# EAGLE design solenoid_1ch (EAGLE 8.1.0)
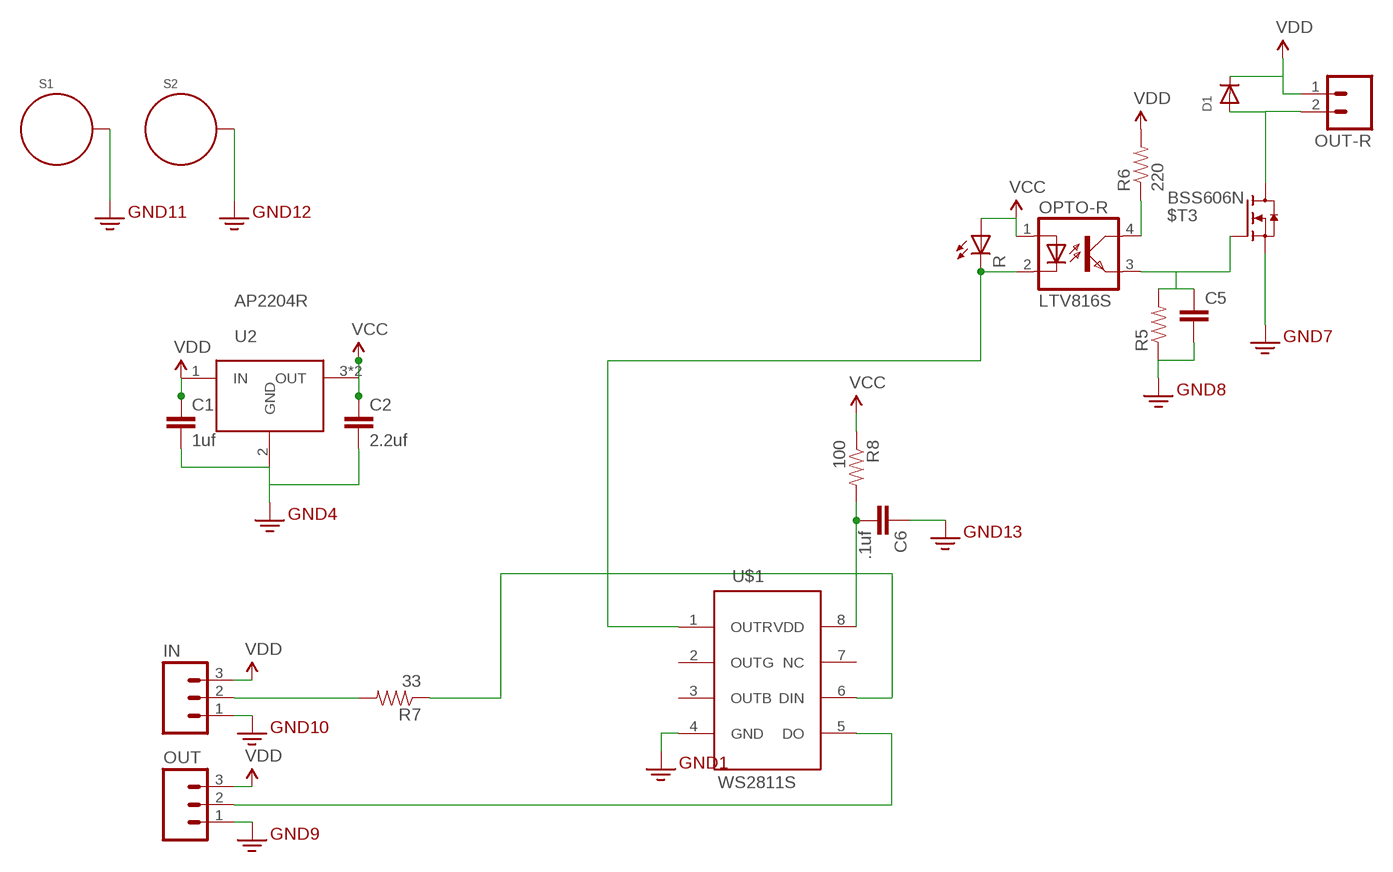
[diagram p0: schematic, sheet 1]

## Parts
$T3  BSS606N  [SOT89R]
C1  1uf  CAP0805  [0805]
C2  2.2uf  CAP0805  [0805]
C5  CAP0805  [0805]
C6  .1uf  CAP0805  [0805]
D1  DIODESOD-123  [SOD-123]
IN  M031X03_NO_SILK  [1X03_NO_SILK]
OPTO-R  LTV816S  [SMD4]
OUT  M031X03_NO_SILK  [1X03_NO_SILK]
OUT-R  M02PTH  [1X02]
R  LEDCHIPLED_0805  [CHIPLED_0805]
R5  RESISTOR0805-RES  [0805]
R6  220  RESISTOR0805-RES  [0805]
R7  33  RESISTOR0805-RES  [0805]
R8  100  RESISTOR0805-RES  [0805]
S1  STANDOFF_ELECTRICAL  [STANDOFF-ELECTRICAL]
S2  STANDOFF_ELECTRICAL  [STANDOFF-ELECTRICAL]
U2  AP2204R  [SOT89R]
U$1  WS2811S  [MSOP8]

## Nets
GND: $T3.1(S) C1.2 C2.2 C5.2 C6.1 IN.1 OUT.1 R5.1 S1.P1 S2.P1 U2.2(GND) U$1.4(GND) ; supply symbol labelled GND2
N$9: OPTO-R.2(C) R.C U$1.1(OUTR)
N$10: $T3.2(G) C5.1 OPTO-R.3(EMIT) R5.2
N$11: OPTO-R.4(COL) R6.1
N$12: $T3.3(D) $T3.4(D) D1.A OUT-R.2
N$13: R7.1 U$1.6(DIN)
N$14: OUT.2 U$1.5(DO)
N$30: IN.2 R7.2
N$31: C6.2 R8.2 U$1.8(VDD)
VCC: C2.1 OPTO-R.1(A) R8.1 R.A U2.3(OUT) U2.4(OUT)
VDD: C1.1 D1.C IN.3 OUT-R.1 OUT.3 R6.2 U2.1(IN)
Unconnected: U$1.2(OUTG) U$1.3(OUTB) U$1.7(NC)

## Library data of the parts
$T3 = mishafarms:BSS606N
C1 C2 C5 C6 = SparkFun-Capacitors:CAP: Capacitor Standard 0603 ceramic capacitor, and 0.1" leaded capacitor.
D1 = microbuilder:DIODE: Diode SMA Model Volts Amps Type Vf Vr Digikey # Notes SSA34-E3 40V 3A Schottky 480mV @ 3A 200uA @ 40V SSA34-E3/61TGITR-ND CDBA120-G 20V 1A Schottky 500mV @ 1A 500uA @ 20V 641-1014-6-ND REEL MBRA210 10V 2A Schottky 350mV @ 2A 700uA @ 10V MBRA210LT3 SOD-123 Model Volts Amps Type Vf Vr Order # Notes BAT54T1G 30V 200mA Schottky 800mV @ 200mA 2uA @ 25V BAT54T1GOSTR-ND B0530W 30V 500mA Schottky 430mV @ 500mA 130uA @ 30V B0530W-FDICT-ND REEL MBR120 1A 20V Schottky 340mV @ 1A MBR120VLSFT1GOSCT-ND SOD-323 Model Volts Amps Type Vf Vr Order # Notes PMEG2005EJ 20V 500mA Schottky 355mV @ 500mA 568-4110-1-ND ZLLS410 10V 570mA Schottky 380mV @ 570mA ZLLS410CT-ND 1N4148WS 75V 150mA Silicon/Simple 1V 1N4148WSFSCT-ND REEL SOD-523 Model Volts Amps Type Vf Vr Order # Notes BAT54XV2 30V 200mA Schottky 0.8V @ 100mA BAT54XV2CT-ND TB751S 30V 30mA Schottky RB751S-40TE61CT-ND SOT23-R/W (R = Solder Paste/Reflow Ovens, W = Hand-Soldering) Model Volts Amps Type Vf Vr Order # Notes BAT54FILM 40V 300mA Schottky 497-7162-1-ND
IN OUT = SparkFun-Connectors:M03: Header 3 Standard 3-pin 0.1" header. Use with straight break away headers (SKU : PRT-00116), right angle break away headers (PRT-00553), swiss pins (PRT-00743), machine pins (PRT-00117), and female headers (PRT-00115). Molex polarized connector foot print use with SKU : PRT-08232 with associated crimp pins and housings.
OPTO-R = optocoupler:LTV816: OPTO COUPLER Source: LITEON, LTV816.pdf; OC_FARNELL: unknown; OC_NEWARK: unknown
OUT-R = SparkFun-Connectors:M02: Standard 2-pin 0.1" header. Use with - straight break away headers ( PRT-00116) - right angle break away headers (PRT-00553) - swiss pins (PRT-00743) - machine pins (PRT-00117) - female headers (PRT-00115) Molex polarized connector foot print use with: PRT-08233 with associated crimp pins and housings. 2.54_SCREWTERM for use with PRT-10571. 3.5mm Screw Terminal footprints for PRT-08084 5mm Screw Terminal footprints for use with PRT-08432
R = led:LED: LED OSRAM: - CHIPLED LG R971, LG N971, LY N971, LG Q971, LY Q971, LO R971, LY R971 LH N974, LH R974 LS Q976, LO Q976, LY Q976 LO Q996 - Hyper CHIPLED LW Q18S LB Q993, LB Q99A, LB R99A - SideLED LS A670, LO A670, LY A670, LG A670, LP A670 LB A673, LV A673, LT A673, LW A673 LH A674 LY A675 LS A676, LA A676, LO A676, LY A676, LW A676 LS A679, LY A679, LG A679 - Hyper Micro SIDELED® LS Y876, LA Y876, LO Y876, LY Y876 LT Y87S - SmartLED LW L88C, LW L88S LB L89C, LB L89S, LG L890 LS L89K, LO L89K, LY L89K LS L896, LA L896, LO L896, LY L896 - TOPLED LS T670, LO T670, LY T670, LG T670, LP T670 LSG T670, LSP T670, LSY T670, LOP T670, LYG T670 LG T671, LOG T671, LSG T671 LB T673, LV T673, LT T673, LW T673 LH T674 LS T676, LA T676, LO T676, LY T676, LB T676, LH T676, LSB T676, LW T676 LB T67C, LV T67C, LT T67C, LS T67K, LO T67K, LY T67K, LW E67C LS E67B, LA E67B, LO E67B, LY E67B, LB E67C, LV E67C, LT E67C LW T67C LS T679, LY T679, LG T679 LS T770, LO T770, LY T770, LG T770, LP T770 LB T773, LV T773, LT T773, LW T773 LH T774 LS E675, LA E675, LY E675, LS T675 LS T776, LA T776, LO T776, LY T776, LB T776 LHGB T686 LT T68C, LB T68C - Hyper Mini TOPLED® LB M676 - Mini TOPLED Santana® LG M470 LS M47K, LO M47K, LY M47K Source: http://www.osram.convergy.de LUXEON: - LUMILED® LXK2-PW12-R00, LXK2-PW12-S00, LXK2-PW14-U00, LXK2-PW14-V00 LXK2-PM12-R00, LXK2-PM12-S00, LXK2-PM14-U00 LXK2-PE12-Q00, LXK2-PE12-R00, LXK2-PE12-S00, LXK2-PE14-T00, LXK2-PE14-U00 LXK2-PB12-K00, LXK2-PB12-L00, LXK2-PB12-M00, LXK2-PB14-N00, LXK2-PB14-P00, LXK2-PB14-Q00 LXK2-PR12-L00, LXK2-PR12-M00, LXK2-PR14-Q00, LXK2-PR14-R00 LXK2-PD12-Q00, LXK2-PD12-R00, LXK2-PD12-S00 LXK2-PH12-R00, LXK2-PH12-S00 LXK2-PL12-P00, LXK2-PL12-Q00, LXK2-PL12-R00 Source: www.luxeon.com KINGBRIGHT: KA-3528ASYC Source: www.kingbright.com
R5-R8 = SparkFun-Passives:RESISTOR: Resistor Basic schematic elements and footprints for 0603, 1206, and PTH resistors.
S1 S2 = SparkFun-Electromechanical:STANDOFF_ELECTRICAL: A standoff intended to be an electrically connected point. Pad size and stop size allow for a #4 Phillips pan screw head to make a solid connection to the board.
U2 = mishafarms:AP2204R; VOLTAGE: 5.0
U$1 = mishafarms:WS2811S

## Board
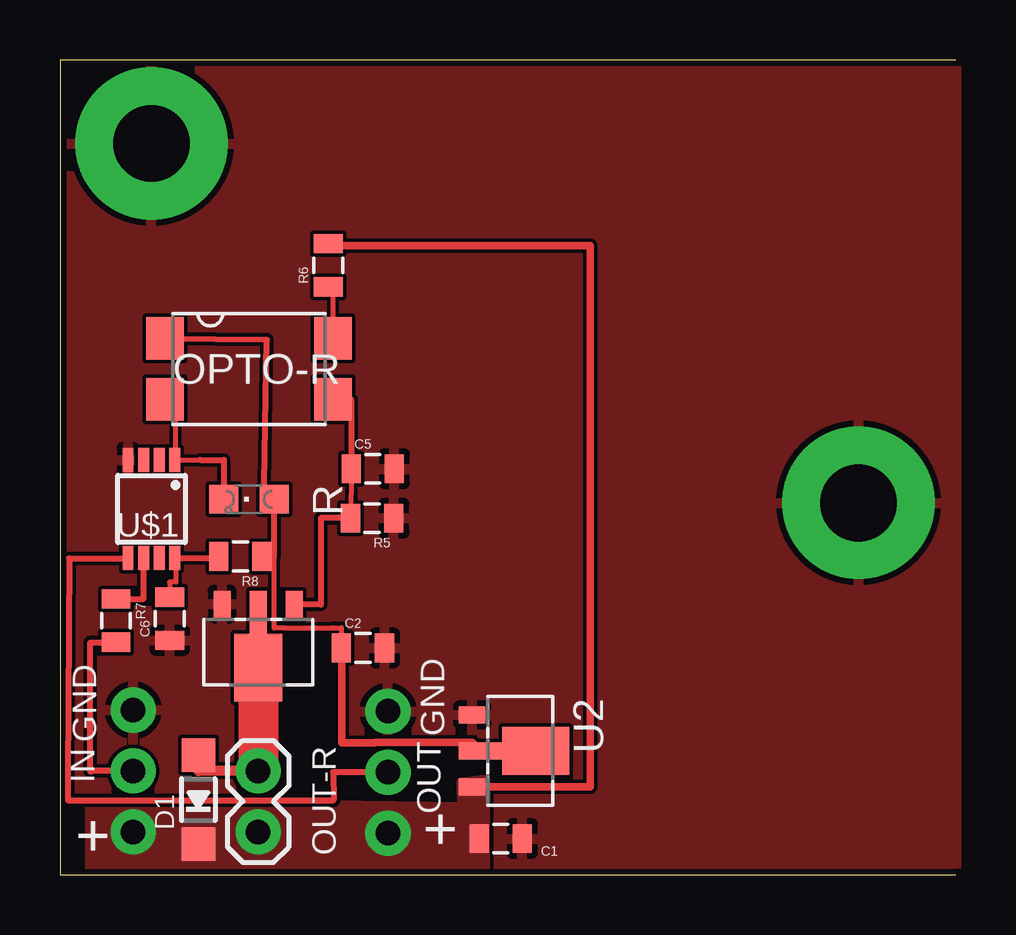
[diagram p1: board, top side]

Size 37.32 x 33.96 mm. Coordinates in mm from the lower left corner, seen from the top.
Outline: 37.32,0 0,0 0,33.96 37.32,33.96
Copper layers (1*16): Top 0.035mm / dielectric 1.5mm / Bottom 0.035mm
Design rules "SeeedStudio_2layer_DRU_no_angle_20140221_mlw": minimum track width 6mil, minimum drill 12mil, track to track 6mil, track to pad 6mil, pad to pad 6mil, via to via 6mil, smd to smd 0mil, copper to edge 10mil, drill to drill 10mil, minimum pad ring 10mil, minimum via ring 6mil, stop-mask expansion 2mil, vias tented up to drill 100mil, thermal gap 10mil

### Footprints (pad centres in the part's own frame; a part is rotated, then mirrored left to right if it is on the bottom)
SOT89R = smd 0.7 x 1.1: 1 1.5,-1.75; 2 -1.5,-1.75 | smd 0.7 x 1.8: 3 0,-1.4 | smd 2 x 2.8: 4 0,0.9
0805 = smd 0.8 x 1.2: 1 -0.9,0; 2 0.9,0
SOD-123 = smd 1.4 x 1.4: A 1.85,0; C -1.85,0
1X03_NO_SILK = drill 1.016 pad 1.88: 1 0,0; 2 2.54,0; 3 5.08,0
SMD4 = smd 1.78 x 1.55: 1 -1.27,-3.5; 2 1.27,-3.5; 3 1.27,3.5; 4 -1.27,3.5
1X02 = drill 1.016 pad 1.88: 1 0,0; 2 2.54,0
CHIPLED_0805 = smd 1.2 x 1.2: A 0,-1.05; C 0,1.05
STANDOFF-ELECTRICAL = drill 3.2 pad 6.35: P1 0,0
MSOP8 = smd 0.45 x 1: 1 -0.975,-2.05; 2 -0.325,-2.05; 3 0.325,-2.05; 4 0.975,-2.05; 5 0.975,2.05; 6 0.325,2.05; 7 -0.325,2.05; 8 -0.975,2.05

### Placement (x,y rotation side)
$T3  8.26,9.53 180 top
C1  18.36,1.5 0 top
C2  12.62,9.45 0 top
C5  13.03,16.92 0 top
C6  4.57,10.67 90 top
D1  5.77,3.12 90 top
IN  3.05,6.86 270 top
OPTO-R  7.87,21.08 270 top
OUT  13.67,6.81 270 top
OUT-R  8.26,1.78 90 top
R  7.87,15.65 90 top
R5  13,14.86 180 top
R6  11.18,25.4 90 top
R7  2.34,10.59 270 top
R8  7.52,13.26 180 top
S1  3.81,30.48 0 top
S2  33.27,15.49 0 top
U2  18.92,5.16 270 top
U$1  3.81,15.24 180 top

### Tracks (layer width: path | path; a pad name or v marks a point on that pad's centre or on a via)
GND
  pour Top (rank 4): 0,0 0,33.66 37.34,33.91 37.34,0.25
N$9
  Top 0.203: OPTO-R.2 4.37,19.56 4.83,19.56 4.83,17.29 U$1.1 5.84,17.29
  Top 0.254: 5.84,17.29 6.82,17.29 R.C
N$10
  Top 0.203: C5.1 R5.2
  Top 0.254: OPTO-R.3 12.13,19.81 C5.1 | R5.2 10.87,14.86 10.87,11.25 9.76,11.25 $T3.2
N$11
  Top 0.203: R6.1 11.37,24.5 OPTO-R.4
N$12
  Top 0.406: $T3.3 $T3.4 | OUT-R.2 5.77,4.32 D1.A
  Top 1.676: $T3.4 OUT-R.2
N$13
  Top 0.254: R7.1 3.48,11.49 U$1.6
N$14
  Top 0.254: OUT.2 11.38,4.27 11.4,3.1 0.33,3.1 0.33,4.06 0.38,13.18 U$1.5
N$30
  Top 0.254: IN.2 1.29,4.32 1.29,4.29 1.27,4.29 1.27,9.68 2.34,9.68 R7.2
N$31
  Top 0.203: U$1.8 4.83,13.19 4.83,12.19 4.57,12.19 C6.2
  Top 0.254: U$1.8 6.62,13.19 R8.2
VCC
  Top 0.203: 8.92,13.26 8.92,10.28 9.36,10.28 11.38,10.29 11.72,10.29 C2.1
  Top 0.254: OPTO-R.1 8.62,22.3 8.51,16.31 8.46,15.62 R.A 8.92,13.26 R8.1
  Top 0.305: U2.3 19.25,5.16 19.25,5.13 | U2.3 U2.4 | C2.1 11.73,9.45 11.73,5.49 13.12,5.49 13.15,5.51 17.17,5.51 U2.3
VDD
  Top 0.305: U2.1 22.1,3.66 22.1,26.21 11.18,26.21 R6.2
  pour Top (no thermals): 17.7,3.96 17.7,0.15 1.27,0 1.27,3.05 16.79,2.82 16.71,3.84

### Text on the board
tPlace: GND | GND | + | +
tDocu: +
bDocu: WS2811 Solenoid driver 1A V0.1 | GND | GND | IN | OUT-R | OUT-G | OUT-B | OUT | 12V | 12V | 12V | 12V | 12V